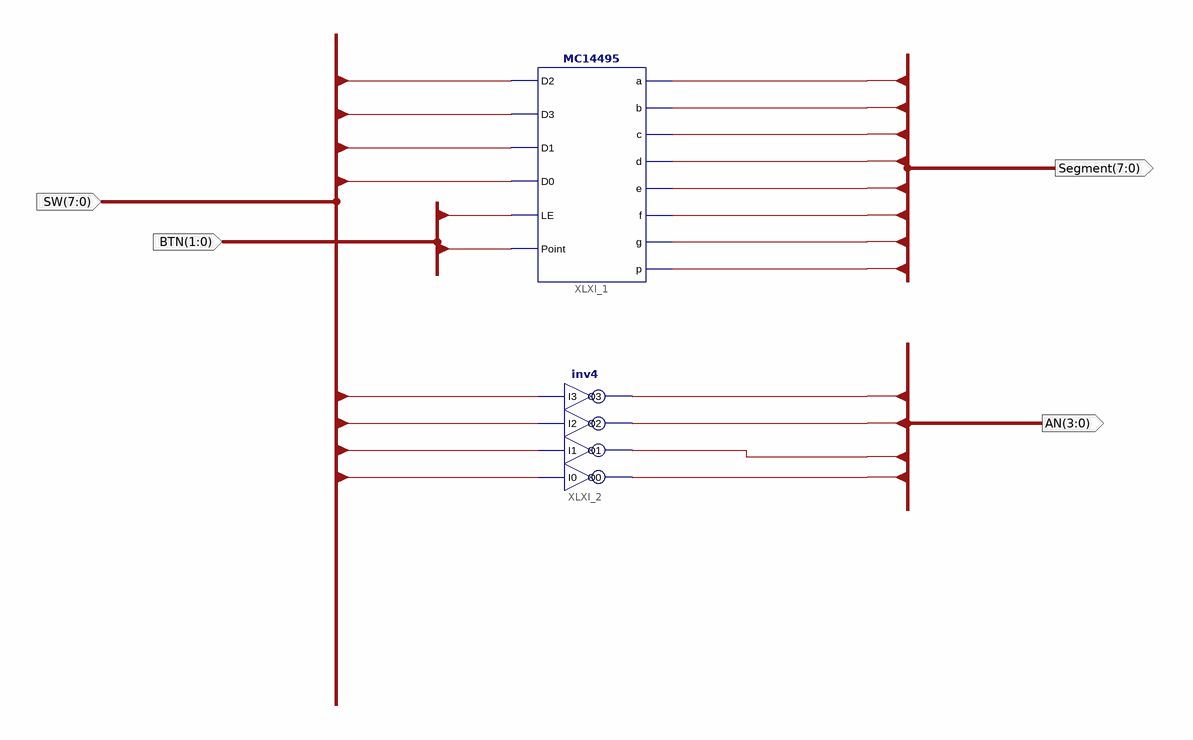
[diagram p0: schematic sheet 1]
// Xilinx ISE schematic DispNumber.sch (artix7) as structural Verilog: 2 symbols, 4 ports
module DispNumber (
  input  [7:0] SW,
  input  [1:0] BTN,
  output [7:0] Segment,
  output [3:0] AN
);

  MC14495 XLXI_1 (
    .D2(SW[2]), .D3(SW[3]), .D1(SW[1]), .D0(SW[0]), .LE(BTN[0]), .Point(BTN[1]), .a(Segment[0]),
    .b(Segment[1]), .c(Segment[2]), .d(Segment[3]), .e(Segment[4]), .f(Segment[5]), .g(Segment[6]),
    .p(Segment[7]));
  inv4 XLXI_2 (.I0(SW[4]), .I1(SW[5]), .I2(SW[6]), .I3(SW[7]), .O0(AN[0]), .O1(AN[1]), .O2(AN[2]), .O3(AN[3]));
endmodule
